# EAGLE design backup_1 (EAGLE 9.6.2)
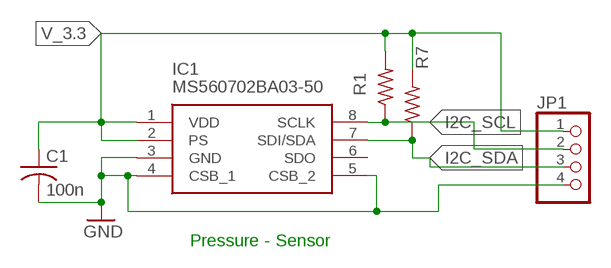
[diagram p0: schematic, sheet 1]

## Parts
C1  100n  C-US050-024X044  [C050-024X044]
IC1  MS560702BA03-50  [MS5607-02BA03]
JP1  PINHD-1X4  [1X04]
R1  10k  R-US_0204/7  [0204/7]
R7  10k  R-US_0204/7  [0204/7]

## Nets
GND [V_bat]: C1.2 IC1.3(GND) IC1.4(CSB_1) IC1.5(CSB_2) JP1.4
I2C_SCL: IC1.8(SCLK) JP1.2 R1.1
I2C_SDA: IC1.7(SDI/SDA) JP1.3 R7.1
V_3.3 [PWR]: C1.1 IC1.1(VDD) IC1.2(PS) JP1.1 R1.2 R7.2
Unconnected: IC1.6(SDO)

## Notes on the sheet
- Pressure - Sensor

## Library data of the parts
C1 = rcl:C-US: CAPACITOR, American symbol; SPICEPREFIX: C
IC1 = MS560702BA03-50:MS560702BA03-50: MS560702BA03-50, Barometric Pressure Sensor, 1200mbar 0 3.6 V Output, 8-Pin QFN Source: Datasheet <http://www.te.com/commerce/DocumentDelivery/DDEController?Action=srchrtrv&DocNm=MS5607-02BA03&DocType=Data Sheet&DocLang=English>; DESCRIPTION: MS560702BA03-50, Barometric Pressure Sensor, 1200mbar 0 3.6 V Output, 8-Pin QFN; HEIGHT: mm; MANUFACTURER_NAME: TE Connectivity; MANUFACTURER_PART_NUMBER: MS560702BA03-50; MOUSER_PART_NUMBER: 824-MS560702BA03-50; MOUSER_PRICE-STOCK: https://www.mouser.co.uk/ProductDetail/Measurement-Specialties/MS560702BA03-50?qs=urSpXqmdEVImCZG1H%252BT8ng%3D%3D
JP1 = pinhead:PINHD-1X4: PIN HEADER
R1 R7 = rcl:R-US_: RESISTOR, American symbol; SPICEPREFIX: R

## Net classes
0 default: width 0.178 mm, clearance 0.152 mm
1 PWR: width 0.254 mm, clearance 0.152 mm
2 V_bat: width 0.305 mm, clearance 0.152 mm

## Board
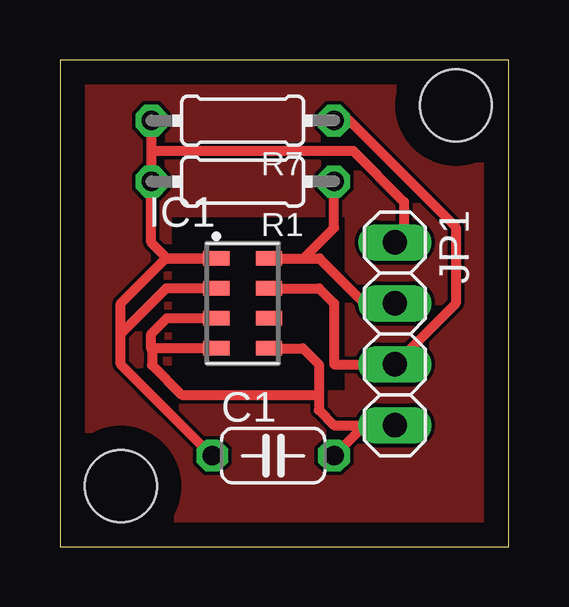
[diagram p1: board, top side]

Size 18.72 x 20.31 mm. Coordinates in mm from the lower left corner, seen from the top.
Outline: 0,0 18.72,0 18.72,20.31 0,20.31 0,0
Copper layers (1*16): Top 0.035mm / dielectric 1.5mm / Bottom 0.035mm
Design rules "default": minimum track width 6mil, minimum drill 0.35mm, track to track 6mil, track to pad 6mil, pad to pad 6mil, via to via 6mil, smd to smd 6mil, copper to edge 40mil, drill to drill 6mil, minimum pad ring 10mil, minimum via ring 8mil, stop-mask expansion 4mil, vias tented up to drill 0mil, thermal gap 10mil
Holes 3 mm at 2.54,2.54 16.51,18.41

### Footprints (pad centres in the part's own frame; a part is rotated, then mirrored left to right if it is on the bottom)
C050-024X044 = drill 0.813 octagon: 1 -2.54,0; 2 2.54,0
MS5607-02BA03 = smd 1.1 x 0.6: 1 -1.1,1.875; 2 -1.1,0.625; 3 -1.1,-0.625; 4 -1.1,-1.875; 5 1.1,-1.875; 6 1.1,-0.625; 7 1.1,0.625; 8 1.1,1.875
1X04 = drill 1.016 long: 1 -3.81,0; 2 -1.27,0; 3 1.27,0; 4 3.81,0
0204/7 = drill 0.813 octagon: 1 -3.81,0; 2 3.81,0

### Placement (x,y rotation side)
C1  8.89,3.81 0 top
IC1  7.62,10.16 0 top
JP1  13.97,8.89 270 top
R1  7.62,15.24 180 top
R7  7.62,17.78 180 top

### Tracks (layer width: path | path; a pad name or v marks a point on that pad's centre or on a via)
GND
  Top 0.406: IC1.3 4.46,9.54 3.81,8.89 3.81,8.26 3.84,8.29 | IC1.5 10.13,8.29 10.79,7.62 10.79,6.35 | 10.79,6.35 10.79,5.71 11.43,5.08 JP1.4 12.7,5.08 C1.2 | IC1.4 3.84,8.29 | 3.84,8.29 3.84,7.59 5.08,6.35 10.79,6.35
GND2
  pour Top: 0,20.95 4.45,20.95 4.45,6.35 -0.64,6.35 -0.64,20.95
  pour Top: 0,6.35 19.68,6.35 19.68,0 0,0
  pour Top: 0,20.32 0,13.97 18.41,13.97 18.41,20.32
  pour Top: 12.06,20.32 12.06,0.64 18.41,0.64 18.41,20.32
I2C_SCL
  Top 0.406: IC1.8 10.16,12.04 | 10.16,12.04 10.82,12.04 12.7,10.16 JP1.2 | 10.16,12.04 11.43,13.3 R1.1
I2C_SDA
  Top 0.406: R7.1 12.06,17.78 16.51,13.34 16.51,10.16 JP1.3 11.43,7.62 11.43,10.16 10.8,10.79 IC1.7
V_3.3
  Top 0.406: C1.1 2.54,7.62 2.54,8.89 | 2.54,8.89 2.54,10.16 4.42,12.04 IC1.1 4.47,12.04 3.81,12.7 R1.2 3.81,16.51 | IC1.2 4.43,10.79 2.54,8.89 | R7.2 3.81,16.51 | JP1.1 14.35,13.08 14.35,14.39 12.23,16.51 3.81,16.51